# Altium schematic sheet STM32F303CCT6.SchDoc
size A4; Author: Wojciech Grędel; CompanyName: AGH Racing; Revision: 1; SheetNumber: 1; SheetTotal: 1; CarNumber: 6; ProjectName: Project Name
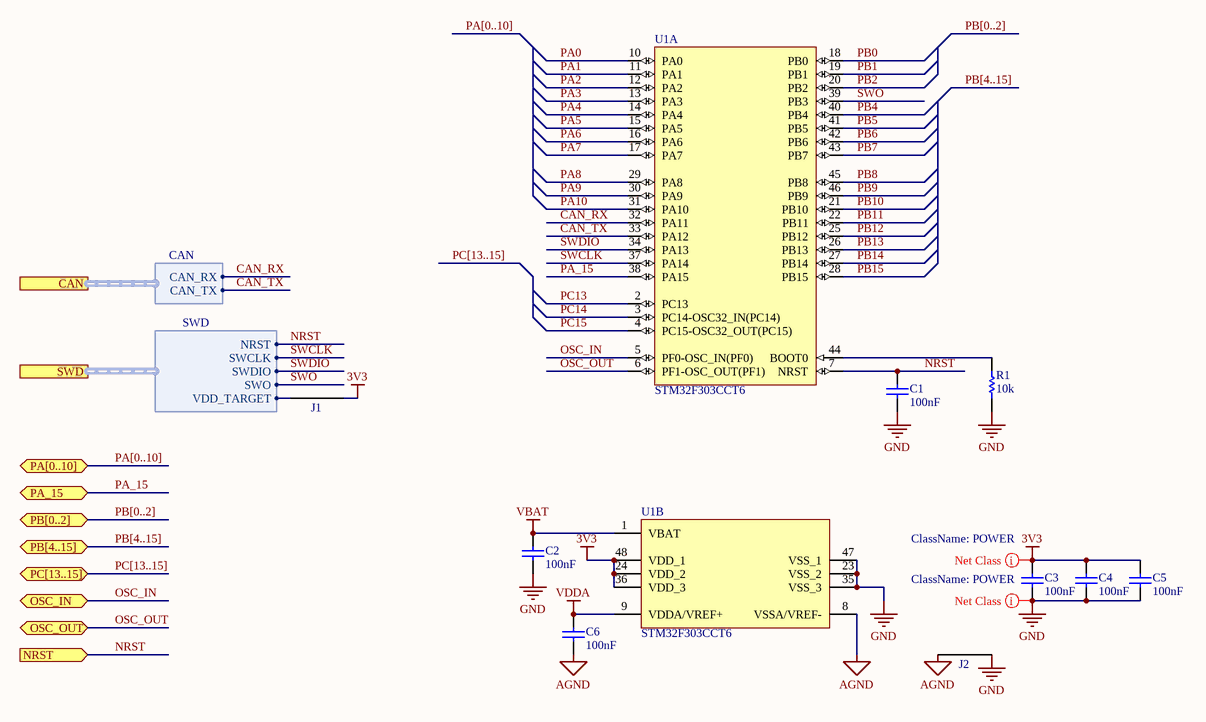
[diagram p0: STM32F303CCT6.SchDoc]

## Parts
C1  value 100nF  [CAP_0603_IPC_MD]  (hidden comment: Cap)
C2  value 100nF  [CAP_0603_IPC_MD]  (hidden comment: Cap)
C3  value 100nF  [CAP_0603_IPC_MD]  (hidden comment: Cap)
C4  value 100nF  [CAP_0603_IPC_MD]  (hidden comment: Cap)
C5  value 100nF  [CAP_0603_IPC_MD]  (hidden comment: Cap)
C6  value 100nF  [CAP_0603_IPC_MD]  (hidden comment: Cap)
J1  NetTie  [NETTIE]  (value not drawn)  (net tie, no BOM)
J2  NetTie  [NETTIE]  (value not drawn)  (net tie, no BOM)
R1  value 10k  [RES_0603_IPC_HD]  (hidden comment: Res)
U1  STM32F303CCT6  [LQFP48_IPC_LD]  (parts A,B of 2)

## Ports
CAN (harness CAN), NRST (in), OSC_IN (bidir), OSC_OUT (bidir), PA[0..10] (bidir), PA_15 (bidir), PB[0..2] (bidir), PB[4..15] (bidir), PC[13..15] (bidir), SWD (harness SWD)

## Harnesses
CAN: CAN_RX, CAN_TX
SWD: NRST, SWCLK, SWDIO, SWO, VDD_TARGET

## Nets
3V3: C3.2 C4.2 C5.2 J1.1 U1.24(VDD_2) U1.36(VDD_3) U1.48(VDD_1)
AGND: C6.1 J2.1 U1.8(VSSA/VREF-)
GND: C1.1 C2.1 C3.1 C4.1 C5.1 J2.2 R1.1 U1.23(VSS_2) U1.35(VSS_3) U1.47(VSS_1)
VBAT: C2.2 U1.1(VBAT)
VDDA: C6.2 U1.9(VDDA/VREF+)
CAN_RX: U1.32(PA11) ; port CAN.CAN_RX
CAN_TX: U1.33(PA12) ; port CAN.CAN_TX
NRST: C1.2 U1.7(NRST) ; port NRST, port SWD.NRST
OSC_IN: U1.5(PF0-OSC_IN(PF0)) ; port OSC_IN
OSC_OUT: U1.6(PF1-OSC_OUT(PF1)) ; port OSC_OUT
PA0: U1.10(PA0)
PA1: U1.11(PA1)
PA2: U1.12(PA2)
PA3: U1.13(PA3)
PA4: U1.14(PA4)
PA5: U1.15(PA5)
PA6: U1.16(PA6)
PA7: U1.17(PA7)
PA8: U1.29(PA8)
PA9: U1.30(PA9)
PA10: U1.31(PA10)
PA_15: U1.38(PA15) ; port PA_15
PB0: U1.18(PB0)
PB1: U1.19(PB1)
PB2: U1.20(PB2)
PB4: U1.40(PB4)
PB5: U1.41(PB5)
PB6: U1.42(PB6)
PB7: U1.43(PB7)
PB8: U1.45(PB8)
PB9: U1.46(PB9)
PB10: U1.21(PB10)
PB11: U1.22(PB11)
PB12: U1.25(PB12)
PB13: U1.26(PB13)
PB14: U1.27(PB14)
PB15: U1.28(PB15)
PC13: U1.2(PC13)
PC14: U1.3(PC14-OSC32_IN(PC14))
PC15: U1.4(PC15-OSC32_OUT(PC15))
SWCLK: U1.37(PA14) ; port SWD.SWCLK
SWDIO: U1.34(PA13) ; port SWD.SWDIO
SWO: U1.39(PB3) ; port SWD.SWO
NetJ1_2: J1.2 ; port SWD.VDD_TARGET
NetR1_2: R1.2 U1.44(BOOT0)

## Buses and harness runs
bus PA[0..10]
bus PA[0..10] = port PA[0..10]
bus PB[0..2]
bus PB[0..2] = port PB[0..2]
bus PB[4..15]
bus PB[4..15] = port PB[4..15]
bus PC[13..15]
bus PC[13..15] = port PC[13..15]

## Layout directives
net class POWER: 3V3, GND

## Notes on the sheet
- Confidential / Not for distribution !
- Document name:
- Designer Name:
- Date/Time:
- Revision:

## Library data of the parts
C1-C6 = Cap: Capacitor
R1 = Res: Resistor
U1 = STM32F303CCT6: ARM Cortex-M4 32-bit MCU, 256 KB Flash, 40 KB Internal RAM, 37 I/Os, 48-pin LQFP, -40 to 85 degC, Tray; D/A Converter: 2x12-bit (2 Channel); FLASH Size (Prog) (kB): 256; I/Os (High Current): 37; Internal RAM Size (kB): 40; Operating Frequency(F) (Processor speed) (MHz): 72; Supply Voltage(Vcc) min (V): 2; DatasheetVersion: Rev. 6; PackageVersion: Rev. 6, 06/2013; PackageReference: LQFP48; PackageDescription: 48-Pin Low Profile Quad Flat Package, 7 x 7 mm Body, 0.5 mm Pitch; Supplier 1: Digi-Key; Supplier Part Number 1: 497-13318-ND; Supplier 2: Newark; Supplier Part Number 2: 46W2192; Supplier 3: Newark; Supplier Part Number 3: 66W7286; Supplier 4: Mouser; Supplier Part Number 4: 511-STM32F303CCT6; Core: ARM Cortex-M4; Packing: Tray; Mounting Technology: Surface Mount; PartNumber: STM32F303CCT6; ComponentLink1Description: Manufacturer URL; ComponentLink1URL: http://www.st.com/web/en/home.html; ComponentLink2Description: Datasheet; ComponentLink2URL: http://www.st.com/st-web-ui/static/active/en/resource/technical/document/datasheet/DM00058181.pdf; ComponentLink3Description: Package Specification; ComponentLink3URL: http://www.st.com/st-web-ui/static/active/en/resource/technical/document/datasheet/DM00058181.pdf